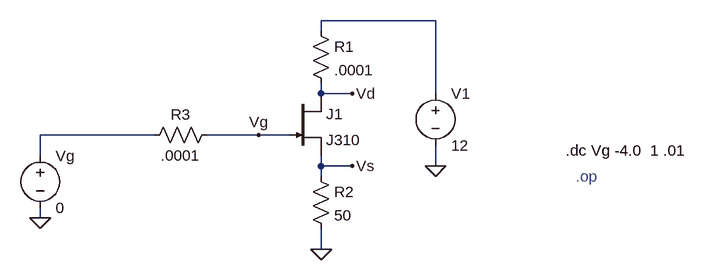
[diagram p0: schematic J310 Input Charasteristic Curve.asc]
J310 Input Charasteristic Curve.asc, the LTspice schematic file:
Version 4
SHEET 1 944 680
WIRE 432 48 256 48
WIRE 256 64 256 48
WIRE 256 160 256 144
WIRE 304 160 256 160
WIRE 432 160 432 48
WIRE 0 224 -176 224
WIRE 160 224 80 224
WIRE 208 224 160 224
WIRE -176 256 -176 224
WIRE 256 272 256 256
WIRE 304 272 256 272
WIRE 432 272 432 240
WIRE 256 288 256 272
WIRE -176 352 -176 336
WIRE 256 400 256 368
FLAG 432 272 0
FLAG 304 272 Vs
FLAG 304 160 Vd
FLAG -176 352 0
FLAG 256 400 0
FLAG 160 224 Vg
SYMBOL njf 208 160 R0
SYMATTR InstName J1
SYMATTR Value J310
SYMBOL voltage 432 144 R0
WINDOW 123 0 0 Left 0
WINDOW 39 0 0 Left 0
SYMATTR InstName V1
SYMATTR Value 12
SYMBOL res 240 48 R0
SYMATTR InstName R1
SYMATTR Value .0001
SYMBOL voltage -176 240 R0
WINDOW 123 0 0 Left 0
WINDOW 39 0 0 Left 0
SYMATTR InstName Vg
SYMATTR Value 0
SYMBOL res 240 272 R0
SYMATTR InstName R2
SYMATTR Value 50
SYMBOL res 96 208 R90
WINDOW 0 0 56 VBottom 2
WINDOW 3 32 56 VTop 2
SYMATTR InstName R3
SYMATTR Value .0001
TEXT 632 248 Left 2 !.dc Vg -4.0  1 .01
TEXT 648 288 Left 2 ;.op

The netlist it stands for:
* J310 Input Charasteristic Curve.asc
J1 Vd Vg Vs J310
V1 N001 0 12
R1 N001 Vd .0001
Vg N002 0 0
R2 Vs 0 50
R3 Vg N002 .0001
.model NJF NJF
.model PJF PJF
.lib standard.jft
.dc Vg -4.0  1 .01
* .op
.backanno
.end